# Altium schematic sheet AirCond_P1 V2.0.SchDoc
size A4
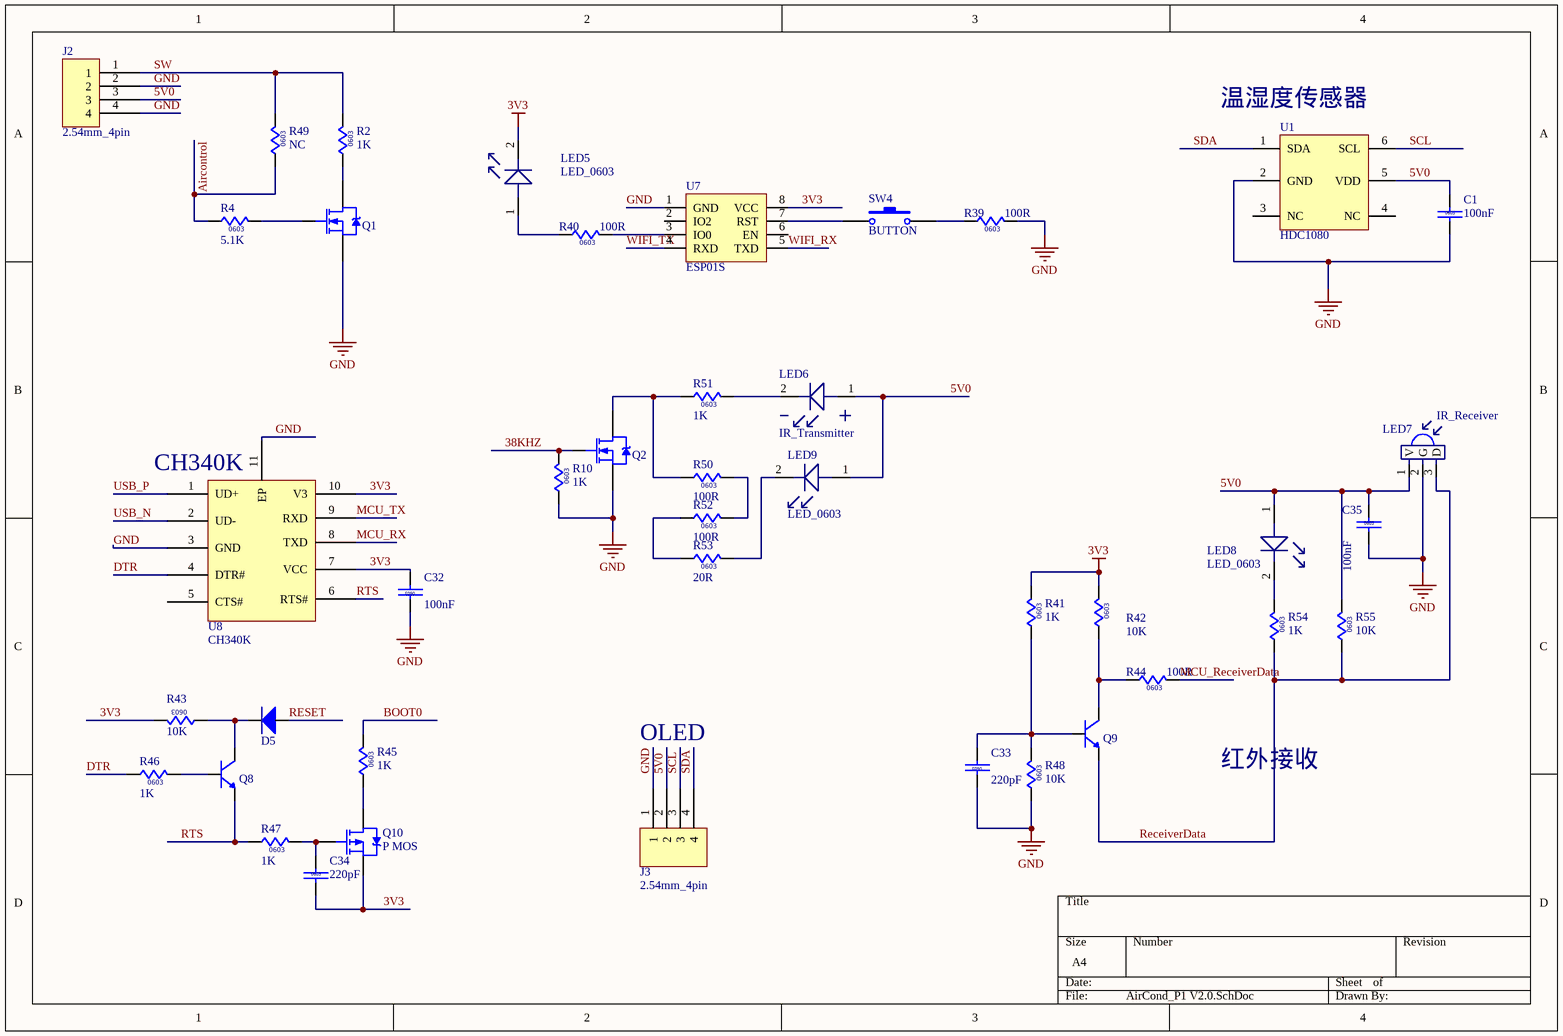
[diagram p0: AirCond_P1 V2.0.SchDoc]

## Parts
C1  100nF  [0603/CAP]
C32  100nF  [0603/CAP]
C33  220pF  [0603/CAP]
C34  220pF  [0603/CAP]
C35  100nF  [0603/CAP]
D5  S1M  [DO-214AC(SMA)]  (value not drawn)
J2  2.54mm_4pin  [2.54mm_4pin]
J3  2.54mm_4pin  [2.54mm_4pin]
LED5  LED_0603  [0603/RES]
LED6  IR_Transmitter  [2.54_2pin]
LED7  IR_Receiver  [2.54mm_3pin]
LED8  LED_0603  [0603/RES]
LED9  LED_0603  [0603/RES]
Q1  NMOS  [SOT-23]  (value not drawn)
Q2  NMOS  [SOT-23]  (value not drawn)
Q8  BC817-16  [SOT-23]  (value not drawn)
Q9  BC817-16  [SOT-23]  (value not drawn)
Q10  P MOS  [SOT-23]
R2  1K  [0603/RES]
R4  5.1K  [0603/RES]
R10  1K  [0603/RES]
R39  100R  [0603/RES]
R40  100R  [0603/RES]
R41  1K  [0603/RES]
R42  10K  [0603/RES]
R43  10K  [0603/RES]
R44  100R  [0603/RES]
R45  1K  [0603/RES]
R46  1K  [0603/RES]
R47  1K  [0603/RES]
R48  10K  [0603/RES]
R49  NC  [0603/RES]
R50  100R  [0603/RES]
R51  1K  [0603/RES]
R52  100R  [0603/RES]
R53  20R  [0603/RES]
R54  1K  [0603/RES]
R55  10K  [0603/RES]
SW4  BUTTON  [Key-D8mm]
U1  HDC1080  [HDC1080]
U7  ESP01S  [2.54MM_2X4PIN]
U8  CH340K  [ESSOP10]

## Nets
3V3: C32.2 C34.2 LED5.2 Q10.2(S) R41.2 R42.2 R43.2 U7.8(VCC) U8.7(VCC) U8.10(V3)
GND: C1.2 C32.1 C33.1 C35.2 J2.2 J2.4 J3.1 LED7.2(G) Q1.2(S) Q2.2(S) R10.1 R39.2 R48.1 U1.2(GND) U7.1(GND) U8.3(GND) U8.11(EP)
5V0: C1.1 C35.1 J2.3 J3.2 LED6.1 LED7.1(V) LED8.1 LED9.1 R55.2 U1.5(VDD)
38KHZ: Q2.1(G) R10.2
Aircontrol: R4.1 R49.1
BOOT0: R45.2
DTR: R46.1 U8.4(DTR#)
MCU_ReceiverData: R44.2
MCU_RX: U8.8(TXD)
MCU_TX: U8.9(RXD)
ReceiverData: LED7.3(D) Q9.2(E) R54.1 R55.1
RESET: D5.1
RTS: Q8.2(E) R47.1 U8.6(RTS#)
SCL: J3.3 U1.6(SCL)
SDA: J3.4 U1.1(SDA)
SW: J2.1 R2.2 R49.2
USB_N: U8.2(UD-)
USB_P: U8.1(UD+)
WIFI_RX: U7.5(TXD)
WIFI_TX: U7.4(RXD)
NetC33_2: C33.2 Q9.1(B) R41.1 R48.2
NetC34_1: C34.1 Q10.1(G) R47.2
NetD5_2: D5.2 Q8.3(C) R43.1
NetLED5_1: LED5.1 R40.1
NetLED6_2: LED6.2 R51.2
NetLED8_2: LED8.2 R54.2
NetLED9_2: LED9.2 R53.2
NetQ1_1: Q1.1(G) R4.2
NetQ1_3: Q1.3(D) R2.1
NetQ2_3: Q2.3(D) R50.1 R51.1
NetQ8_1: Q8.1(B) R46.2
NetQ9_3: Q9.3(C) R42.1 R44.1
NetQ10_3: Q10.3(D) R45.1
NetR39_1: R39.1 SW4.2
NetR40_2: R40.2 U7.3(IO0)
NetR50_2: R50.2 R52.2
NetR52_1: R52.1 R53.1
NetSW4_1: SW4.1 U7.7(RST)

Not connected (* = marked no-connect by the designer): U1 3(NC) 4(NC); U7 2(IO2) 6(EN); U8 5(CTS#)

## Notes on the sheet
- (near U1) 温湿度传感器
- (near U8) CH340K
- OLED
- 红外接收
- (in symbol CAP/0603) 0603
- (in symbol RES/0603) 0603

## Library data of the parts
C1 C32-C35 = CAP/0603
D5 = S1M: S1M: DO-214AC; S2MAH: DO-214AC
Q1 Q2 = N-MOSE: TSM340N06P: TSM340N06P
Q8 Q9 = NPN
Q10 = PMOS-3: P-Channel Power MOSFET; Note: Pin 4 not drawn and electrically connected to Pin 2.; Published: 8-Jun-2000; LatestRevisionDate: 17-Jul-2002; LatestRevisionNote: Re-released for DXP Platform.; DatasheetVersion: PD-9.390D; PackageVersion: Feb-1997; PackageReference: TO-220AB; Publisher: Altium Limited; PackageDescription: TO, Thru-Hole, Vertical, Heatsink Mounted; 3 In-Line Leads; Pitch 2.54 mm; ComponentLink1Description: Manufacturer Link; ComponentLink1URL: http://www.irf.com/
R2 R4 R10 R39-R55 = RES/0603
SW4 = BUTTON_1